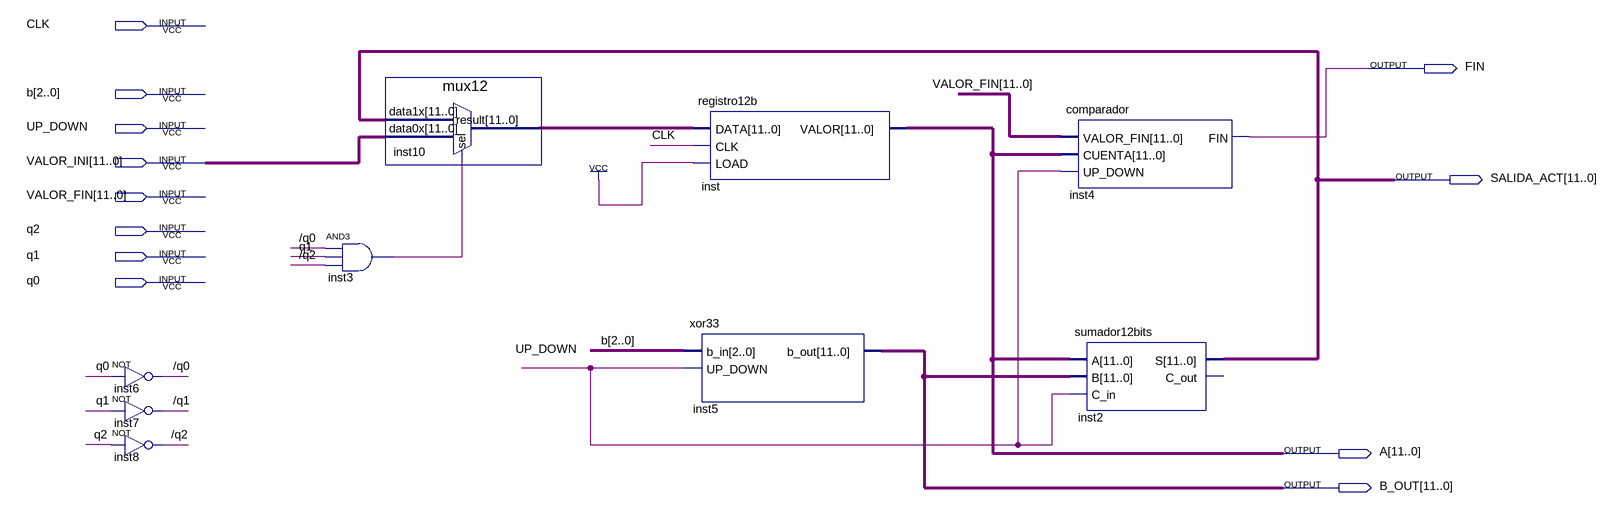
[diagram p0: schematic sheet]
// Quartus schematic Contador.bdf as structural Verilog: 9 symbols, 12 pins
module Contador (
  input  CLK,
  input  [2:0] b,
  input  UP_DOWN,
  input  [11:0] VALOR_INI,
  input  [11:0] VALOR_FIN,
  input  q2,
  input  q1,
  input  q0,
  output FIN,
  output [11:0] SALIDA_ACT,
  output [11:0] A,
  output [11:0] B_OUT
);

  wire \/q0 , \/q1 , \/q2 , inst3_out;
  wire [11:0] inst10_result;

  not inst6 (\/q0 , q0);
  not inst7 (\/q1 , q1);
  not inst8 (\/q2 , q2);
  and inst3 (inst3_out, \/q0 , q1, \/q2 );
  mux12 inst10 (.data1x(SALIDA_ACT), .data0x(VALOR_INI), .sel(inst3_out), .result(inst10_result));
  registro12b inst (.DATA(inst10_result), .CLK(CLK), .LOAD(1'b1), .VALOR(A));
  xor33 inst5 (.b_in(b), .UP_DOWN(UP_DOWN), .b_out(B_OUT));
  comparador inst4 (.VALOR_FIN(VALOR_FIN), .CUENTA(A), .UP_DOWN(UP_DOWN), .FIN(FIN));
  sumador12bits inst2 (.A(A), .B(B_OUT), .C_in(UP_DOWN), .S(SALIDA_ACT));  // open: C_out
endmodule
